# Altium schematic sheet Cover.SchDoc
size A3; SheetNumber: 1; SheetTotal: 2
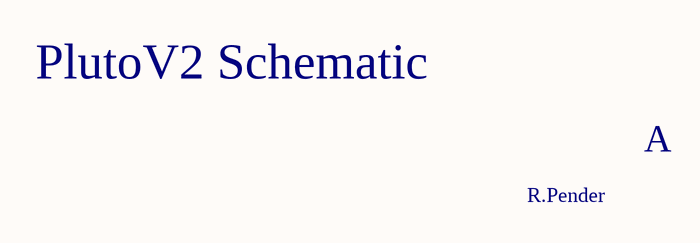
[diagram p0: Cover.SchDoc]

## Notes on the sheet
- PlutoV2 Schematic
- A
- R.Pender